# Altium schematic sheet 2_Topology.SchDoc
size A4; Organization: SpaceLab UFSC; Address1: UFSC - SpaceLab; Address2: University Campus - Trindade; Address3: Dep. of Electrical Engineering - CTC; Address4: Florianópolis, Santa Catarina, Brazil; Address5: CEP: 88040 - 900
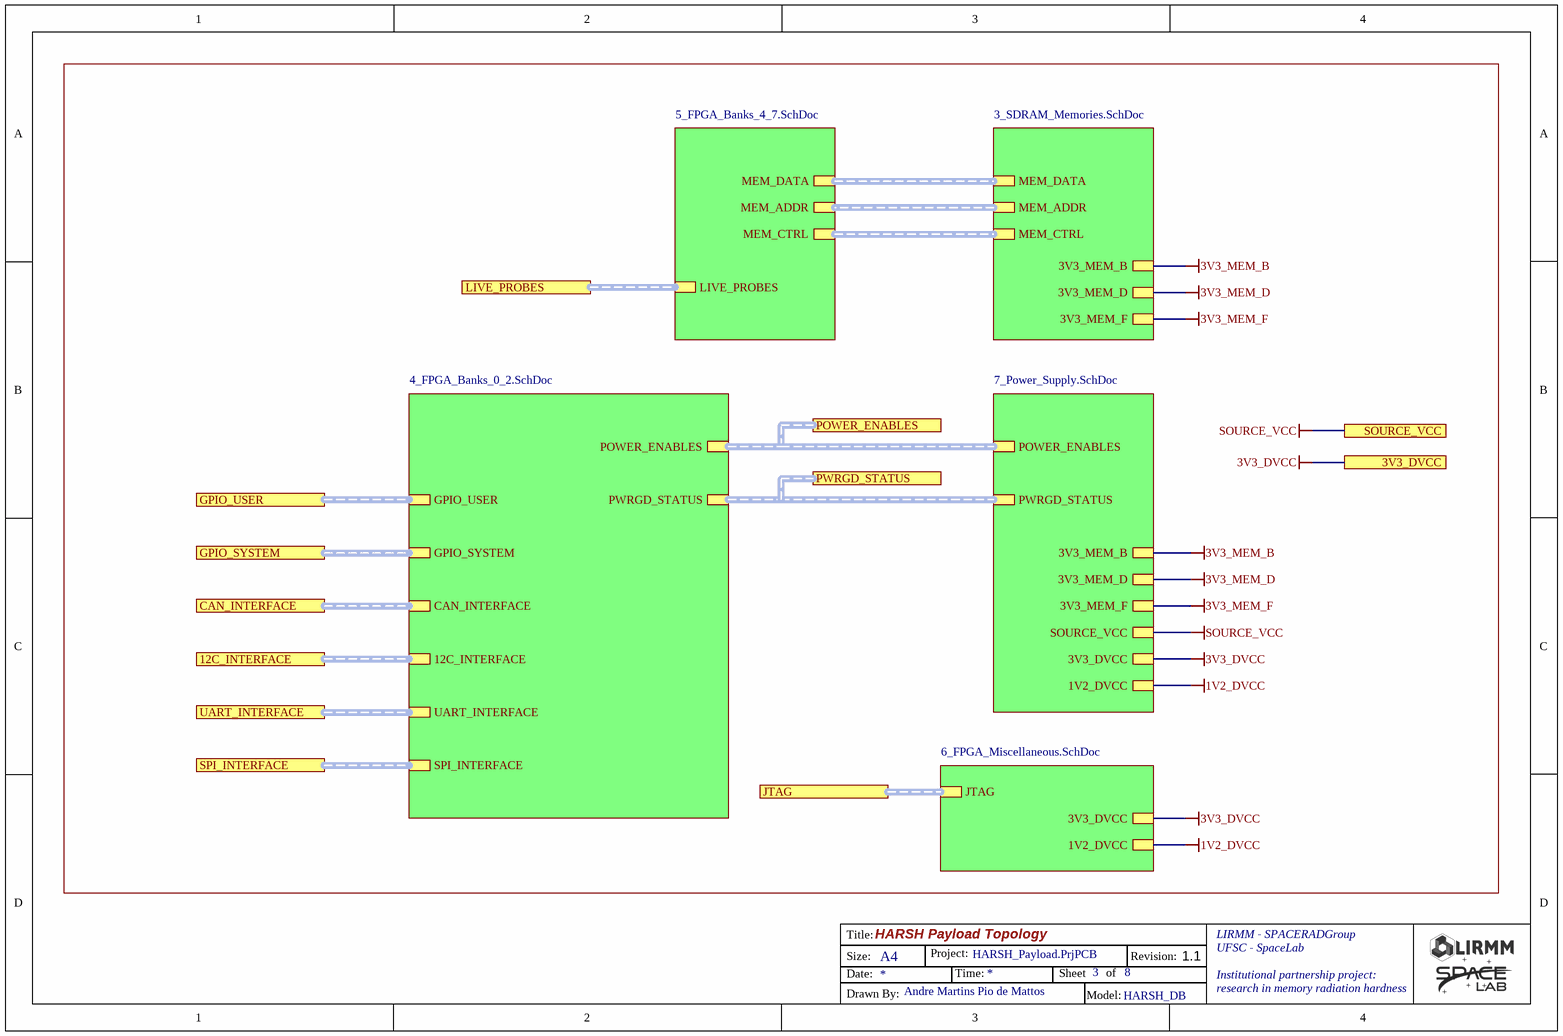
[diagram p0: 2_Topology.SchDoc]

## Sub-sheets
Banks_0_2 = 4_FPGA_Banks_0_2.SchDoc: GPIO_SYSTEM (harness GPIO_SYSTEM), POWER_ENABLES (harness POWER_ENABLES), GPIO_USER (harness GPIO_USER), CAN_INTERFACE (harness CAN_INTERFACE), 12C_INTERFACE (harness I2C_INTERFACE), UART_INTERFACE (harness UART_INTERFACE), SPI_INTERFACE (harness SPI_INTERFACE), PWRGD_STATUS (harness PWRGD_STATUS)
Banks_4_7 = 5_FPGA_Banks_4_7.SchDoc: MEM_DATA (harness MEM_DATA), MEM_ADDR (harness MEM_ADDR), MEM_CTRL (harness MEM_CTRL), LIVE_PROBES (harness LIVE_PROBES)
FPGA_Misc = 6_FPGA_Miscellaneous.SchDoc: JTAG (harness JTAG), 3V3_DVCC, 1V2_DVCC
Memories = 3_SDRAM_Memories.SchDoc: MEM_DATA (harness MEM_DATA), MEM_ADDR (harness MEM_ADDR), MEM_CTRL (harness MEM_CTRL), 3V3_MEM_B, 3V3_MEM_D, 3V3_MEM_F
Power_Supply = 7_Power_Supply.SchDoc: POWER_ENABLES (harness POWER_ENABLES), 3V3_DVCC, 1V2_DVCC, SOURCE_VCC, 3V3_MEM_B, 3V3_MEM_D, 3V3_MEM_F, PWRGD_STATUS (harness PWRGD_STATUS)

## Ports
3V3_DVCC, 12C_INTERFACE (harness I2C_INTERFACE), CAN_INTERFACE (harness CAN_INTERFACE), GPIO_SYSTEM (harness GPIO_SYSTEM), GPIO_USER (harness GPIO_USER), JTAG (harness GPIO_USER), LIVE_PROBES (harness GPIO_USER), POWER_ENABLES (harness POWER_ENABLES), PWRGD_STATUS (harness POWER_ENABLES), SOURCE_VCC, SPI_INTERFACE (harness SPI_INTERFACE), UART_INTERFACE (harness UART_INTERFACE)

## Nets
1V2_DVCC: sheet Power_Supply/1V2_DVCC, sheet FPGA_Misc/1V2_DVCC
3V3_DVCC: port 3V3_DVCC, sheet Power_Supply/3V3_DVCC, sheet FPGA_Misc/3V3_DVCC
3V3_MEM_B: sheet Memories/3V3_MEM_B, sheet Power_Supply/3V3_MEM_B
3V3_MEM_D: sheet Memories/3V3_MEM_D, sheet Power_Supply/3V3_MEM_D
3V3_MEM_F: sheet Memories/3V3_MEM_F, sheet Power_Supply/3V3_MEM_F
SOURCE_VCC: port SOURCE_VCC, sheet Power_Supply/SOURCE_VCC

## Buses and harness runs
harness port 12C_INTERFACE = sheet Banks_0_2/12C_INTERFACE
harness port CAN_INTERFACE = sheet Banks_0_2/CAN_INTERFACE
harness port GPIO_SYSTEM = sheet Banks_0_2/GPIO_SYSTEM
harness port GPIO_USER = sheet Banks_0_2/GPIO_USER
harness port JTAG = sheet FPGA_Misc/JTAG
harness port LIVE_PROBES = sheet Banks_4_7/LIVE_PROBES
harness port POWER_ENABLES = sheet Banks_0_2/POWER_ENABLES = sheet Power_Supply/POWER_ENABLES
harness port PWRGD_STATUS = sheet Banks_0_2/PWRGD_STATUS = sheet Power_Supply/PWRGD_STATUS
harness port SPI_INTERFACE = sheet Banks_0_2/SPI_INTERFACE
harness port UART_INTERFACE = sheet Banks_0_2/UART_INTERFACE
harness sheet Banks_4_7/MEM_ADDR = sheet Memories/MEM_ADDR
harness sheet Banks_4_7/MEM_CTRL = sheet Memories/MEM_CTRL
harness sheet Banks_4_7/MEM_DATA = sheet Memories/MEM_DATA

## Notes on the sheet
- HARSH Payload Topology
- HARSH_Payload.PrjPCB
- 3
- 8
- 1.1
- Andre Martins Pio de Mattos
- HARSH_DB
- Title:
- Size:
- Date:
- A4
- Project:
- Time:
- Sheet
- of
- Revision:
- LIRMM - SPACERADGroup
- UFSC - SpaceLab
- Institutional partnership project:
- research in memory radiation hardness
- Drawn By:
- Model: